# Altium schematic sheet Sayma_mezz_top.SchDoc: =ProjectName
size 420 x 297 mm; Author: SBH; CompanyName: WUT; DrawnBy: SBH; Organization: ISE-WUT; Address1: Warsaw Univeristy of Technology; Address2: Nowowiejska 15/19; Revision: -; SheetNumber: -; SheetTotal: -; EDA_Number: ARTIQ; Projet: Sayma_Mezzanine; ModifiedBy: -; CreateDate: XX/XX/XXXX; CheckedDate: -; Title2: Sayma_mezz_top.SchDoc; DivGrp: ISE; Designer: SBH; ModifiedDate: -; ProjectName: Sayma_Mezzanine
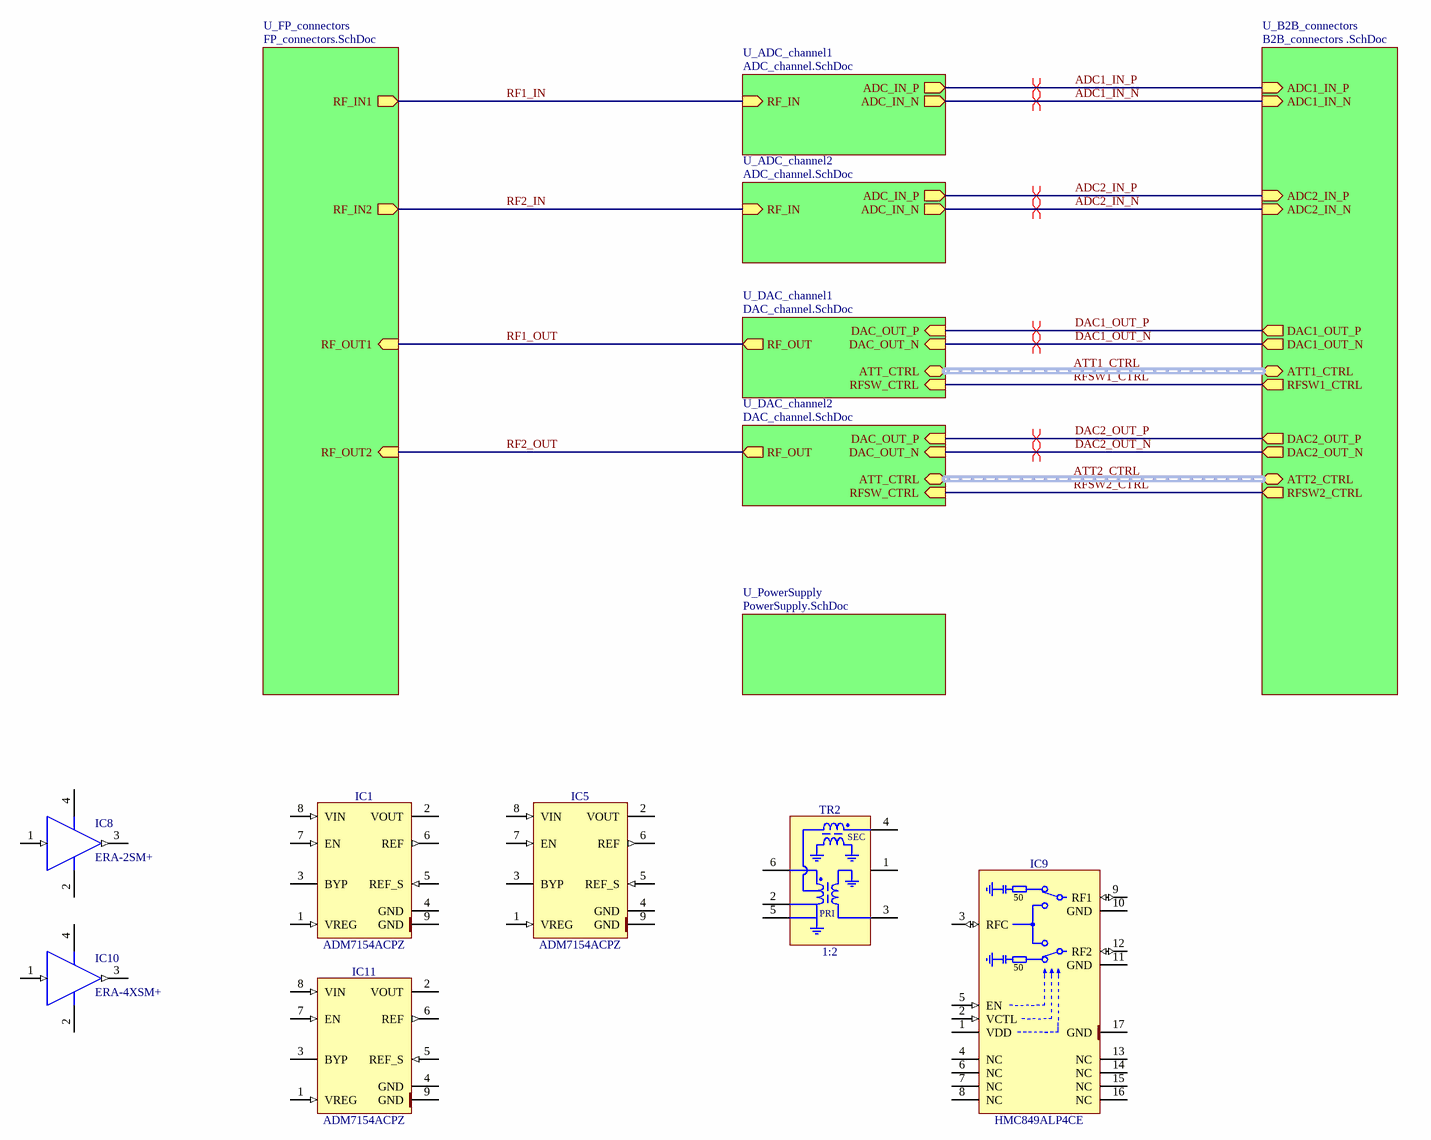
[diagram p0: Sayma_mezz_top.SchDoc]

## Parts
IC1  ADM7154ACPZ  [SON50P300X300X80-9N-R170X244]
IC5  ADM7154ACPZ  [SON50P300X300X80-9N-R170X244]
IC8  ERA-2SM+  [MINI-CIRCUITS_WW107]
IC9  HMC849ALP4CE  [QFN65P400X400X100-17N-S255]
IC10  ERA-4XSM+  [MINI-CIRCUITS_WW107]
IC11  ADM7154ACPZ  [SON50P300X300X80-9N-R170X244]
TR2  1:2  [XFMR_MINI-CIRCUITS_DB1627]

## Sub-sheets
U_ADC_channel1 = ADC_channel.SchDoc: ADC_IN_N (out), ADC_IN_P (out), RF_IN (in)
U_ADC_channel2 = ADC_channel.SchDoc: ADC_IN_P (out), ADC_IN_N (out), RF_IN (in)
U_B2B_connectors = B2B_connectors .SchDoc: ADC1_IN_N (in), ADC1_IN_P (in), DAC1_OUT_N (out), DAC1_OUT_P (out), DAC2_OUT_N (out), DAC2_OUT_P (out), ADC2_IN_N (in), ADC2_IN_P (in), ATT1_CTRL (harness ATT_CTRL), ATT2_CTRL (harness ATT_CTRL), RFSW1_CTRL (out), RFSW2_CTRL (out)
U_DAC_channel1 = DAC_channel.SchDoc: DAC_OUT_P (in), DAC_OUT_N (in), RF_OUT (out), ATT_CTRL (harness ATT_CTRL), RFSW_CTRL (in)
U_DAC_channel2 = DAC_channel.SchDoc: DAC_OUT_P (in), DAC_OUT_N (in), RF_OUT (out), RFSW_CTRL (in), ATT_CTRL (harness ATT_CTRL)
U_FP_connectors = FP_connectors.SchDoc: RF_IN1 (out), RF_IN2 (out), RF_OUT1 (in), RF_OUT2 (in)
U_PowerSupply = PowerSupply.SchDoc: no entries

## Nets
ADC1_IN_N: sheet U_ADC_channel1/ADC_IN_N, sheet U_B2B_connectors/ADC1_IN_N
ADC1_IN_P: sheet U_ADC_channel1/ADC_IN_P, sheet U_B2B_connectors/ADC1_IN_P
ADC2_IN_N: sheet U_ADC_channel2/ADC_IN_N, sheet U_B2B_connectors/ADC2_IN_N
ADC2_IN_P: sheet U_ADC_channel2/ADC_IN_P, sheet U_B2B_connectors/ADC2_IN_P
DAC1_OUT_N: sheet U_DAC_channel1/DAC_OUT_N, sheet U_B2B_connectors/DAC1_OUT_N
DAC1_OUT_P: sheet U_DAC_channel1/DAC_OUT_P, sheet U_B2B_connectors/DAC1_OUT_P
DAC2_OUT_N: sheet U_DAC_channel2/DAC_OUT_N, sheet U_B2B_connectors/DAC2_OUT_N
DAC2_OUT_P: sheet U_DAC_channel2/DAC_OUT_P, sheet U_B2B_connectors/DAC2_OUT_P
RF1_IN: sheet U_ADC_channel1/RF_IN, sheet U_FP_connectors/RF_IN1
RF1_OUT: sheet U_DAC_channel1/RF_OUT, sheet U_FP_connectors/RF_OUT1
RF2_IN: sheet U_ADC_channel2/RF_IN, sheet U_FP_connectors/RF_IN2
RF2_OUT: sheet U_DAC_channel2/RF_OUT, sheet U_FP_connectors/RF_OUT2
RFSW1_CTRL: sheet U_DAC_channel1/RFSW_CTRL, sheet U_B2B_connectors/RFSW1_CTRL
RFSW2_CTRL: sheet U_DAC_channel2/RFSW_CTRL, sheet U_B2B_connectors/RFSW2_CTRL

Not connected (* = marked no-connect by the designer): IC1 1(VREG) 2(VOUT) 3(BYP) 4(GND) 5(REF_S) 6(REF) 7(EN) 8(VIN) 9(GND); IC5 1(VREG) 2(VOUT) 3(BYP) 4(GND) 5(REF_S) 6(REF) 7(EN) 8(VIN) 9(GND); IC8 1(RF_IN) 2(GND) 3(RF_OUT) 4(GND); IC9 1(VDD) 2(VCTL) 3(RFC) 4(NC) 5(EN) 6(NC) 7(NC) 8(NC) 9(RF1) 10(GND) 11(GND) 12(RF2) 13(NC) 14(NC) 15(NC) 16(NC) 17(GND); IC10 1(RF_IN) 2(GND) 3(RF_OUT) 4(GND); IC11 1(VREG) 2(VOUT) 3(BYP) 4(GND) 5(REF_S) 6(REF) 7(EN) 8(VIN) 9(GND); TR2 1(NC) 2(P) 3(S) 4(SD) 5(GND) 6(P1)

## Buses and harness runs
harness ATT1_CTRL = sheet U_B2B_connectors/ATT1_CTRL = sheet U_DAC_channel1/ATT_CTRL
harness ATT2_CTRL = sheet U_B2B_connectors/ATT2_CTRL = sheet U_DAC_channel2/ATT_CTRL

## Layout directives
differential pair: ADC1_IN_N, ADC1_IN_P, ADC2_IN_N, ADC2_IN_P, DAC1_OUT_N, DAC1_OUT_P, DAC2_OUT_N, DAC2_OUT_P

## Notes on the sheet
- Project/Equipment
- Document
- Designer
- Drawn by
- Check.by
- File
- Last Mod.
- Print Date
- Sheet
- Size
- A3
- of
- Rev
- (in symbol HMC849ALP4CE) 50
- (in symbol XFMR_MINI-CIRCUITS_TCM2-33WX+) SEC; PRI

## Library data of the parts
IC1 = ADM7154ACPZ-3.3: 800 mA Ultralow Noise, High PSRR, RF Linear Regulator; Part Description: 3.3V, 600 mA, Ultralow Noise,  High PSRR, RF Linear Regulator; Manufacturer: ANALOG DEVICES; PressFit: No; Bonding: No; Part Number: ADM7154ACPZ-3.3; Component Kind: Standard; Component Type: Standard; Device: ADM7154ACPZ; PackageDescription: SON, (DFN) 0.50mm,pitch; 8 pin,3.00mm W X 3.00mm L X 0.80mm H body (w/thermal tab 1.7 X2.44mm), IPC Medium Density; Manufacturer Part Number: ADM7154ACPZ; Pin Count: 9; Case: SON8; Mounted: Yes; Socket: No; SMD: Yes; Sense: No; ComponentHeight: 0.8mm; HelpURL: \\cern.ch\dfs\Applications\Altium\Datasheets\ADM7154ACPZ.pdf; Author: CERN DEM MR; CreateDate: 30.11.2016; LatestRevisionDate: 30.11.2016
IC5 = ADM7154ACPZ-1.2: 800 mA Ultralow Noise, High PSRR, RF Linear Regulator; Part Description: 1.2V, 600 mA, Ultralow Noise,  High PSRR, RF Linear Regulator; Manufacturer: ANALOG DEVICES; PressFit: No; Bonding: No; Part Number: ADM7154ACPZ-1.2; Component Kind: Standard; Component Type: Standard; Device: ADM7154ACPZ; PackageDescription: SON, (DFN) 0.50mm,pitch; 8 pin,3.00mm W X 3.00mm L X 0.80mm H body (w/thermal tab 1.7 X2.44mm), IPC Medium Density; Manufacturer Part Number: ADM7154ACPZ; Pin Count: 9; Case: SON8; Mounted: Yes; Socket: No; SMD: Yes; Sense: No; ComponentHeight: 0.8mm; HelpURL: \\cern.ch\dfs\Applications\Altium\Datasheets\ADM7154ACPZ.pdf; Author: CERN DEM MR; CreateDate: 30.11.2016; LatestRevisionDate: 30.11.2016
IC8 = ERA-2SM+: DC-5GHz Monolithic Amplifier; Part Description: DC-6GHz Monolithic Amplifier; Manufacturer: MINI-CIRCUITS; PressFit: No; Bonding: No; Part Number: ERA-2SM+; Component Kind: Standard; Component Type: Standard; Device: ERA-2SM+; PackageDescription: MINI-CIRCUITS WW107 Case; Manufacturer Part Number: ERA-2SM+; Pin Count: 4; Mounted: Yes; Socket: No; SMD: Yes; Sense: No; ComponentHeight: 1.52mm; Author: CERN DEM JLC; HelpURL: \\cern.ch\dfs\Applications\Altium\Datasheets\ERA-2SM+.pdf; ComponentLink1URL: \\cern.ch\dfs\Applications\Altium\Datasheets\ERA-2SM+_Package-Drawing.pdf; ComponentLink1Description: Package Drawing; CreateDate: 09.12.2013; LatestRevisionDate: 09.12.2013
IC9 = HMC849ALP4CE: High Isolation SPDT Non-Reflective Switch SMT, DC - 6 GHz; Manufacturer: ANALOG DEVICES; PressFit: No; Bonding: No; Part Number: HMC849ALP4CE; Component Kind: Standard; Component Type: Standard; Device: HMC849ALP4CE; PackageDescription: QFN, 0.65mm pitch,square; 4 pin X 4 pin, 4mm X 4mm X 1mm H body (w/thermal tab 2.55 X 2.55mm),  IPC Medium Density; Part Description: High Isolation SPDT Non-Reflective Switch SMT, DC - 6 GHz; Manufacturer Part Number: HMC849ALP4CE; Pin Count: 17; Case: QFN16; Mounted: Yes; Socket: No; SMD: Yes; Sense: No; ComponentHeight: 1mm; Author: CERN DEM MR; HelpURL: \\cern.ch\dfs\Applications\Altium\Datasheets\HMC849ALP4CE.pdf; CreateDate: 01.12.2016; LatestRevisionDate: 01.12.2016
IC10 = ERA-4XSM+: DC-4GHz Monolithic Amplifier; Manufacturer: MINI-CIRCUITS; PressFit: No; Bonding: No; Part Number: ERA-4XSM+; Component Kind: Standard; Component Type: Standard; Device: ERA-4XSM+; PackageDescription: MINI-CIRCUITS WW107 Case, Body 2.16mm Diameter X 1.52mm H; Part Description: DC-4GHz Monolithic Amplifier; Manufacturer Part Number: ERA-4XSM+; Pin Count: 4; Mounted: Yes; Socket: No; SMD: Yes; Sense: No; ComponentHeight: 1.52mm; Author: CERN DEM JMW; HelpURL: \\cern.ch\dfs\Applications\Altium\Datasheets\ERA-4XSM+.pdf; CreateDate: 11.08.2016; LatestRevisionDate: 11.08.2016
IC11 = ADM7154ACPZ-1.8: 800 mA Ultralow Noise, High PSRR, RF Linear Regulator; Part Description: 1.8V, 600 mA, Ultralow Noise,  High PSRR, RF Linear Regulator; Manufacturer: ANALOG DEVICES; PressFit: No; Bonding: No; Part Number: ADM7154ACPZ-1.8; Component Kind: Standard; Component Type: Standard; Device: ADM7154ACPZ; PackageDescription: SON, (DFN) 0.50mm,pitch; 8 pin,3.00mm W X 3.00mm L X 0.80mm H body (w/thermal tab 1.7 X2.44mm), IPC Medium Density; Manufacturer Part Number: ADM7154ACPZ; Pin Count: 9; Case: SON8; Mounted: Yes; Socket: No; SMD: Yes; Sense: No; ComponentHeight: 0.8mm; HelpURL: \\cern.ch\dfs\Applications\Altium\Datasheets\ADM7154ACPZ.pdf; Author: CERN DEM MR; CreateDate: 30.11.2016; LatestRevisionDate: 30.11.2016
TR2 = XFMR_MINI-CIRCUITS_TCM2-33WX+: 50 OHMS 10 to 3000 MHz RF Transformer; Power: 0.4W; Part Number: XFMR_MINI-CIRCUITS_TCM2-33WX+; Component Kind: Standard; Component Type: Standard; Pin Count: 6; Value: 1:2; Status: None; Part Description: 50 Ohms 10 to 3000MHz RF Transformer; Manufacturer: MINI-CIRCUITS; Manufacturer Part Number: TCM2-33WX+; Mounted: Yes; Socket: No; Sense: No; SMD: Yes; ComponentHeight: 4.06mm; HelpURL: \\cern.ch\dfs\Applications\Altium\Datasheets\XFMR_MINI-CIRCUITS_TCM2-33WX+.pdf; Author: CERN DEM MR; CreateDate: 01.12.2016; LatestRevisionDate: 01.12.2016